# EAGLE design pulse_generator (EAGLE 9.6.2)
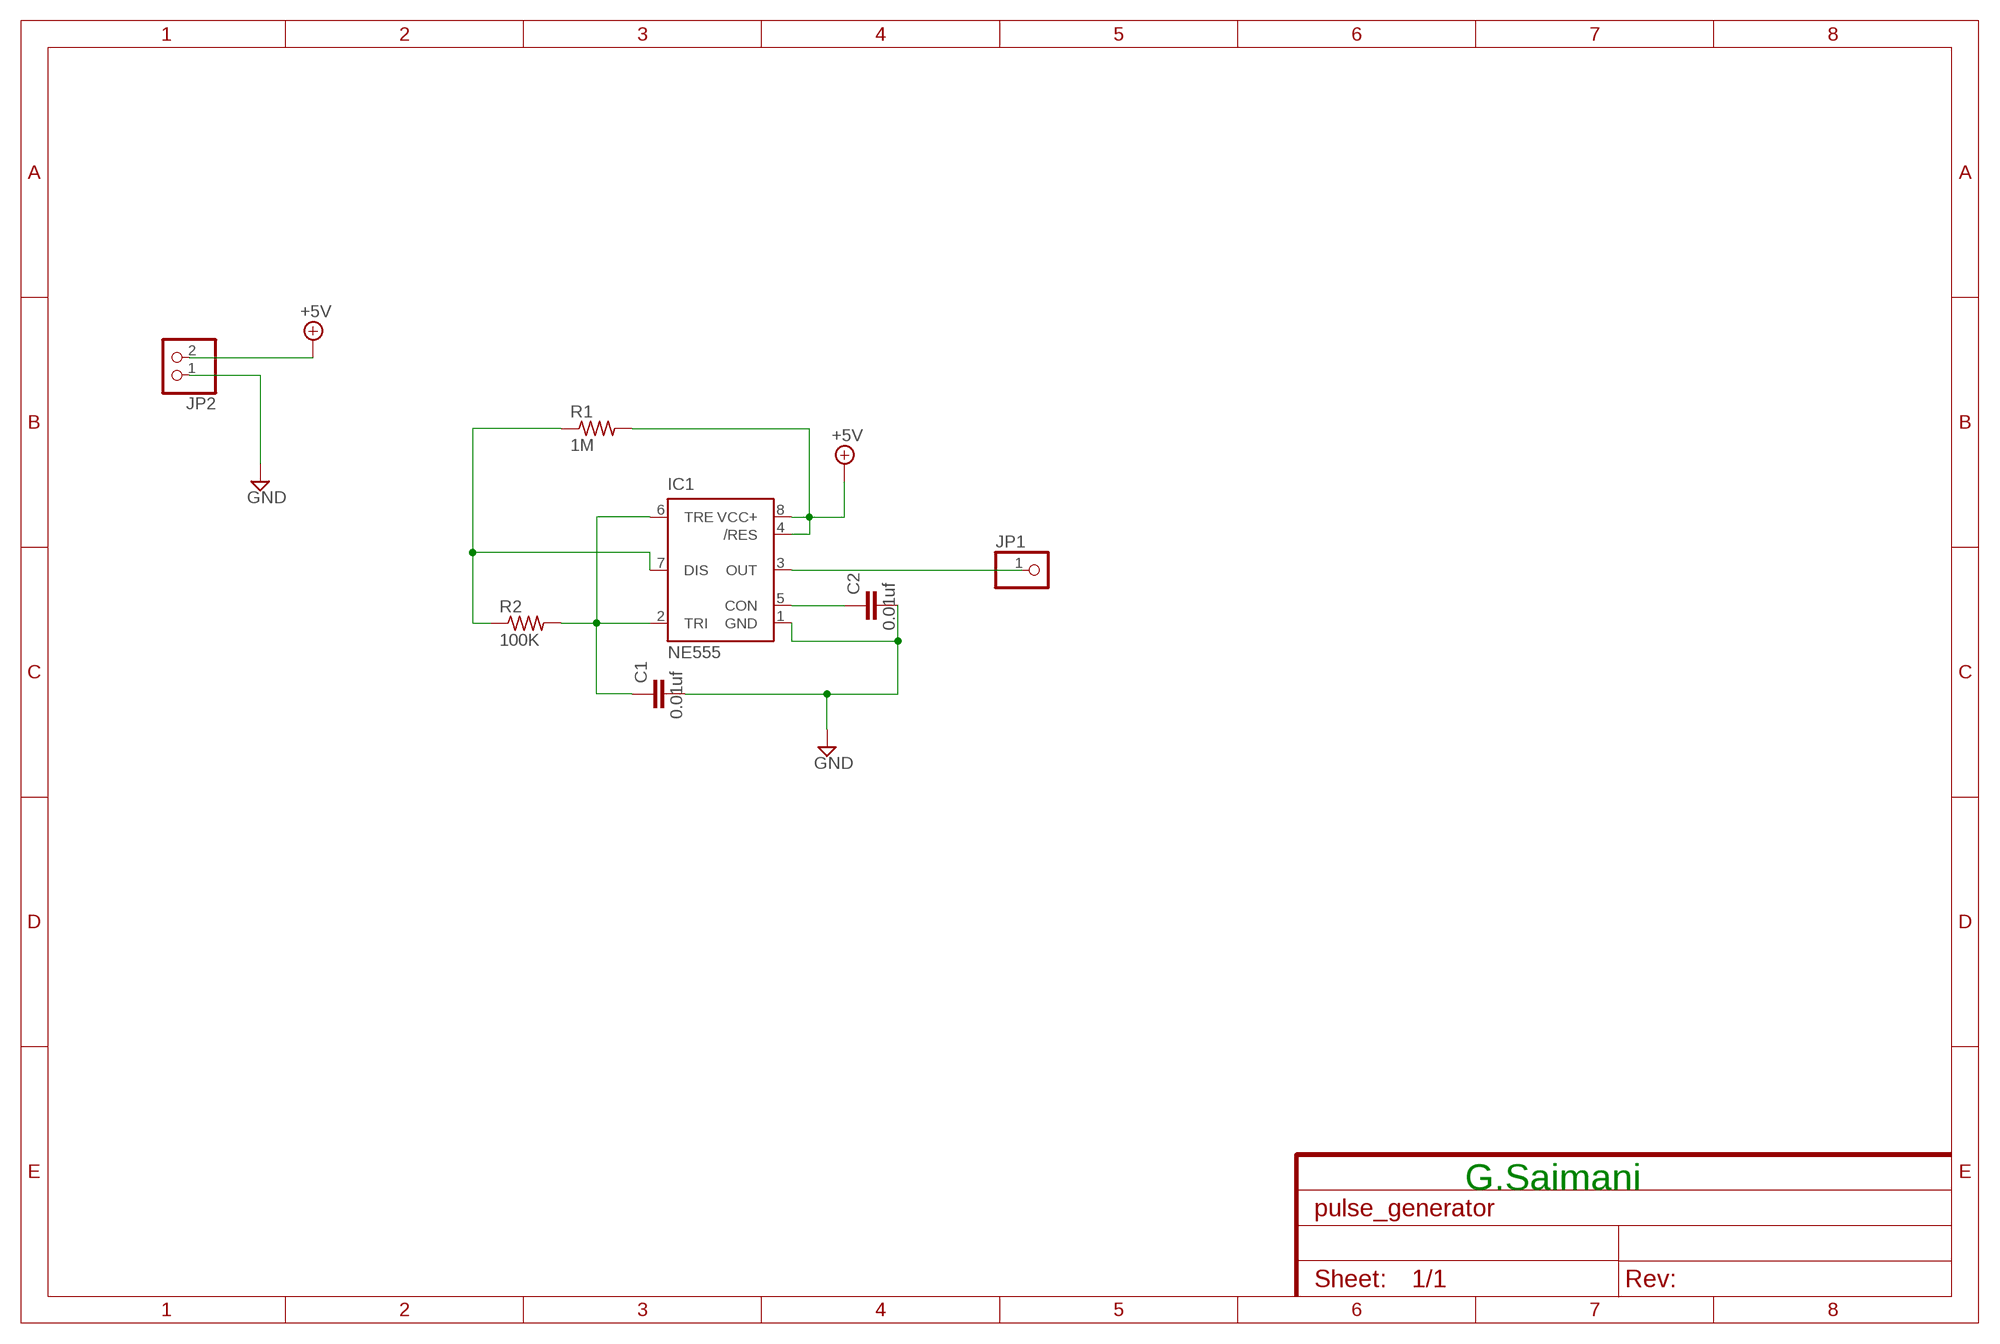
[diagram p0: schematic, sheet 1]

## Parts
C1  0.01uf  C-EU050-024X044  [C050-024X044]
C2  0.01uf  C-EU050-024X044  [C050-024X044]
IC1  NE555  [DIL-08]
JP1  PINHD-1X1  [1X01]
JP2  PINHD-1X2  [1X02]
R1  1M  R-US_0204/7  [0204/7]
R2  100K  R-US_0204/7  [0204/7]

## Nets
+5V: IC1.4(/RES) IC1.8(VCC+) JP2.2 R1.2
GND: C1.2 C2.2 IC1.1(GND) JP2.1
N$1: C1.1 IC1.2(TRI) IC1.6(TRE) R2.2
N$2: IC1.3(OUT) JP1.1
N$3: IC1.7(DIS) R1.1 R2.1
N$5: C2.1 IC1.5(CON)

## Notes on the sheet
- G.Saimani

## Library data of the parts
C1 C2 = rcl:C-EU: CAPACITOR, European symbol; SPICEPREFIX: C
IC1 = st-microelectronics:NE555: General purpose bipolar Timer; MF: Arrow Electronics; MPN: NE555N; OC_FARNELL: 1467742; OC_NEWARK: 89K1486
JP1 = pinhead:PINHD-1X1: PIN HEADER
JP2 = pinhead:PINHD-1X2: PIN HEADER
R1 R2 = rcl:R-US_: RESISTOR, American symbol; SPICEPREFIX: R

## Board
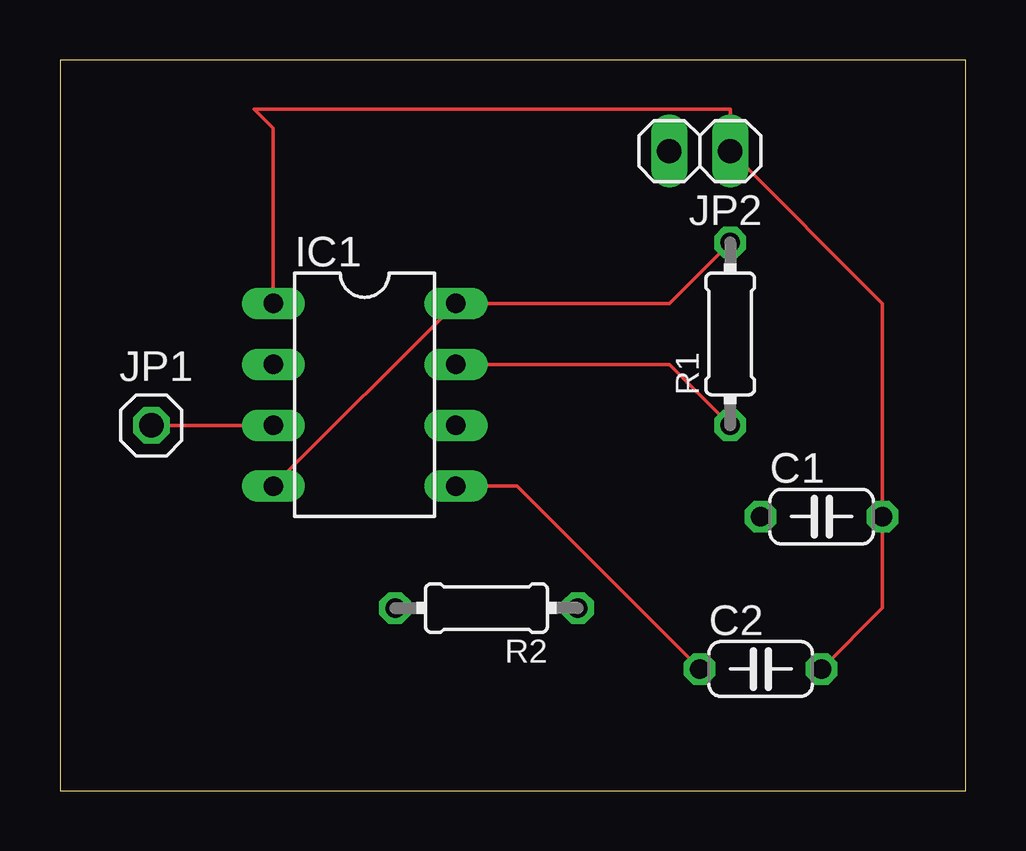
[diagram p1: board, top side]
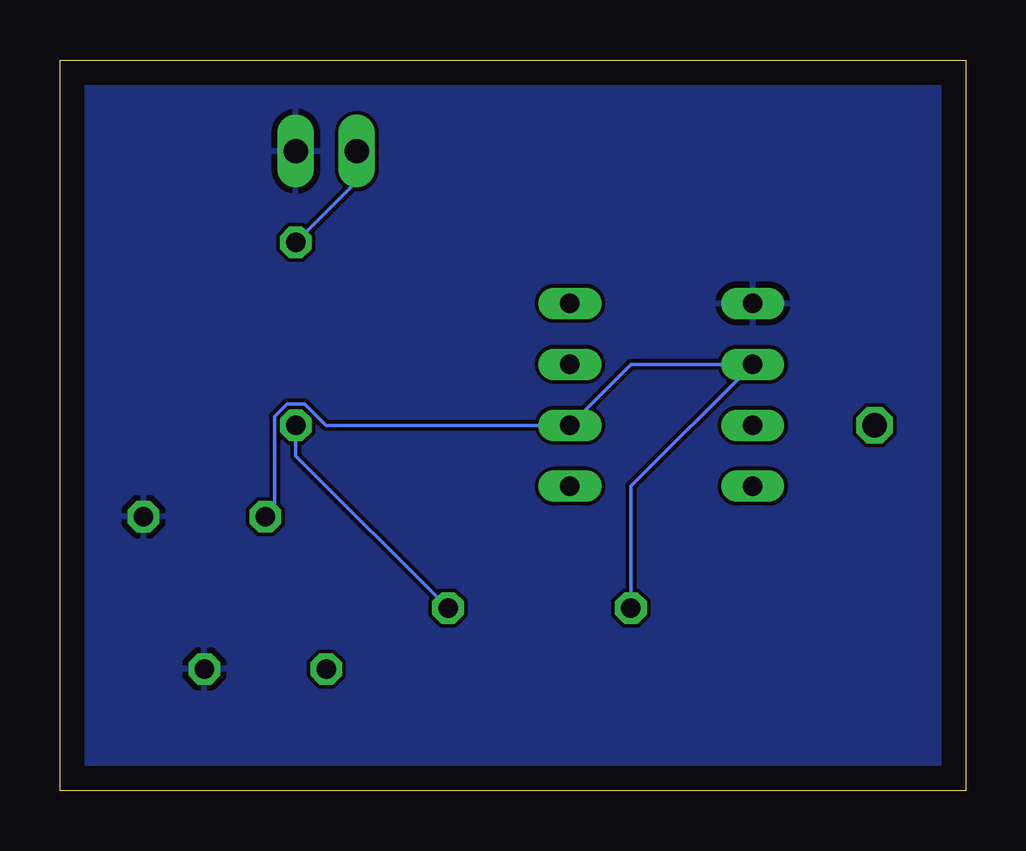
[diagram p2: board, bottom side, seen from below]

Size 37.77 x 30.47 mm. Coordinates in mm from the lower left corner, seen from the top.
Outline: 0,0 37.77,0 37.77,30.47 0,30.47 0,0
Copper layers (1*16): Top 0.035mm / dielectric 1.5mm / Bottom 0.035mm
Design rules "default": minimum track width 6mil, minimum drill 0.35mm, track to track 6mil, track to pad 6mil, pad to pad 6mil, via to via 6mil, smd to smd 6mil, copper to edge 40mil, drill to drill 6mil, minimum pad ring 10mil, minimum via ring 8mil, stop-mask expansion 4mil, vias tented up to drill 0mil, thermal gap 10mil

### Footprints (pad centres in the part's own frame; a part is rotated, then mirrored left to right if it is on the bottom)
C050-024X044 = drill 0.813 octagon: 1 -2.54,0; 2 2.54,0
DIL-08 = drill 0.813 long: 1 -3.81,-3.81; 2 -1.27,-3.81; 3 1.27,-3.81; 4 3.81,-3.81; 5 3.81,3.81; 6 1.27,3.81; 7 -1.27,3.81; 8 -3.81,3.81
1X01 = drill 1.016 octagon: 1 0,0
1X02 = drill 1.016 long: 1 -1.27,0; 2 1.27,0
0204/7 = drill 0.813 octagon: 1 -3.81,0; 2 3.81,0

### Placement (x,y rotation side)
C1  31.75,11.43 0 top
C2  29.21,5.08 0 top
IC1  12.7,16.51 270 top
JP1  3.81,15.24 0 top
JP2  26.67,26.67 180 top
R1  27.94,19.05 90 top
R2  17.78,7.62 180 top

### Tracks (layer width: path | path; a pad name or v marks a point on that pad's centre or on a via)
+5V
  Top 0.152: R1.2 25.4,20.32 IC1.8 IC1.4
  Bottom 0.152: R1.2 25.4,25.4 JP2.2
GND
  Top 0.152: IC1.1 8.89,27.64 8.1,28.42 27.94,28.42 JP2.1 34.29,20.32 C1.2 34.29,7.62 C2.2
  pour Bottom: 0,0 38.1,0 38.1,30.48 0,30.48
N$1
  Bottom 0.152: R2.2 13.97,12.7 IC1.2 13.97,17.78 IC1.6 26.68,15.24 27.57,16.13 28.31,16.13 28.83,15.61 28.83,11.81 C1.1
N$2
  Top 0.152: IC1.3 JP1.1
N$3
  Top 0.152: IC1.7 25.4,17.78 R1.1
  Bottom 0.152: R1.1 27.94,13.97 R2.1
N$5
  Top 0.152: C2.1 19.05,12.7 IC1.5